# EAGLE design MicroProcessor (EAGLE 9.6.0)
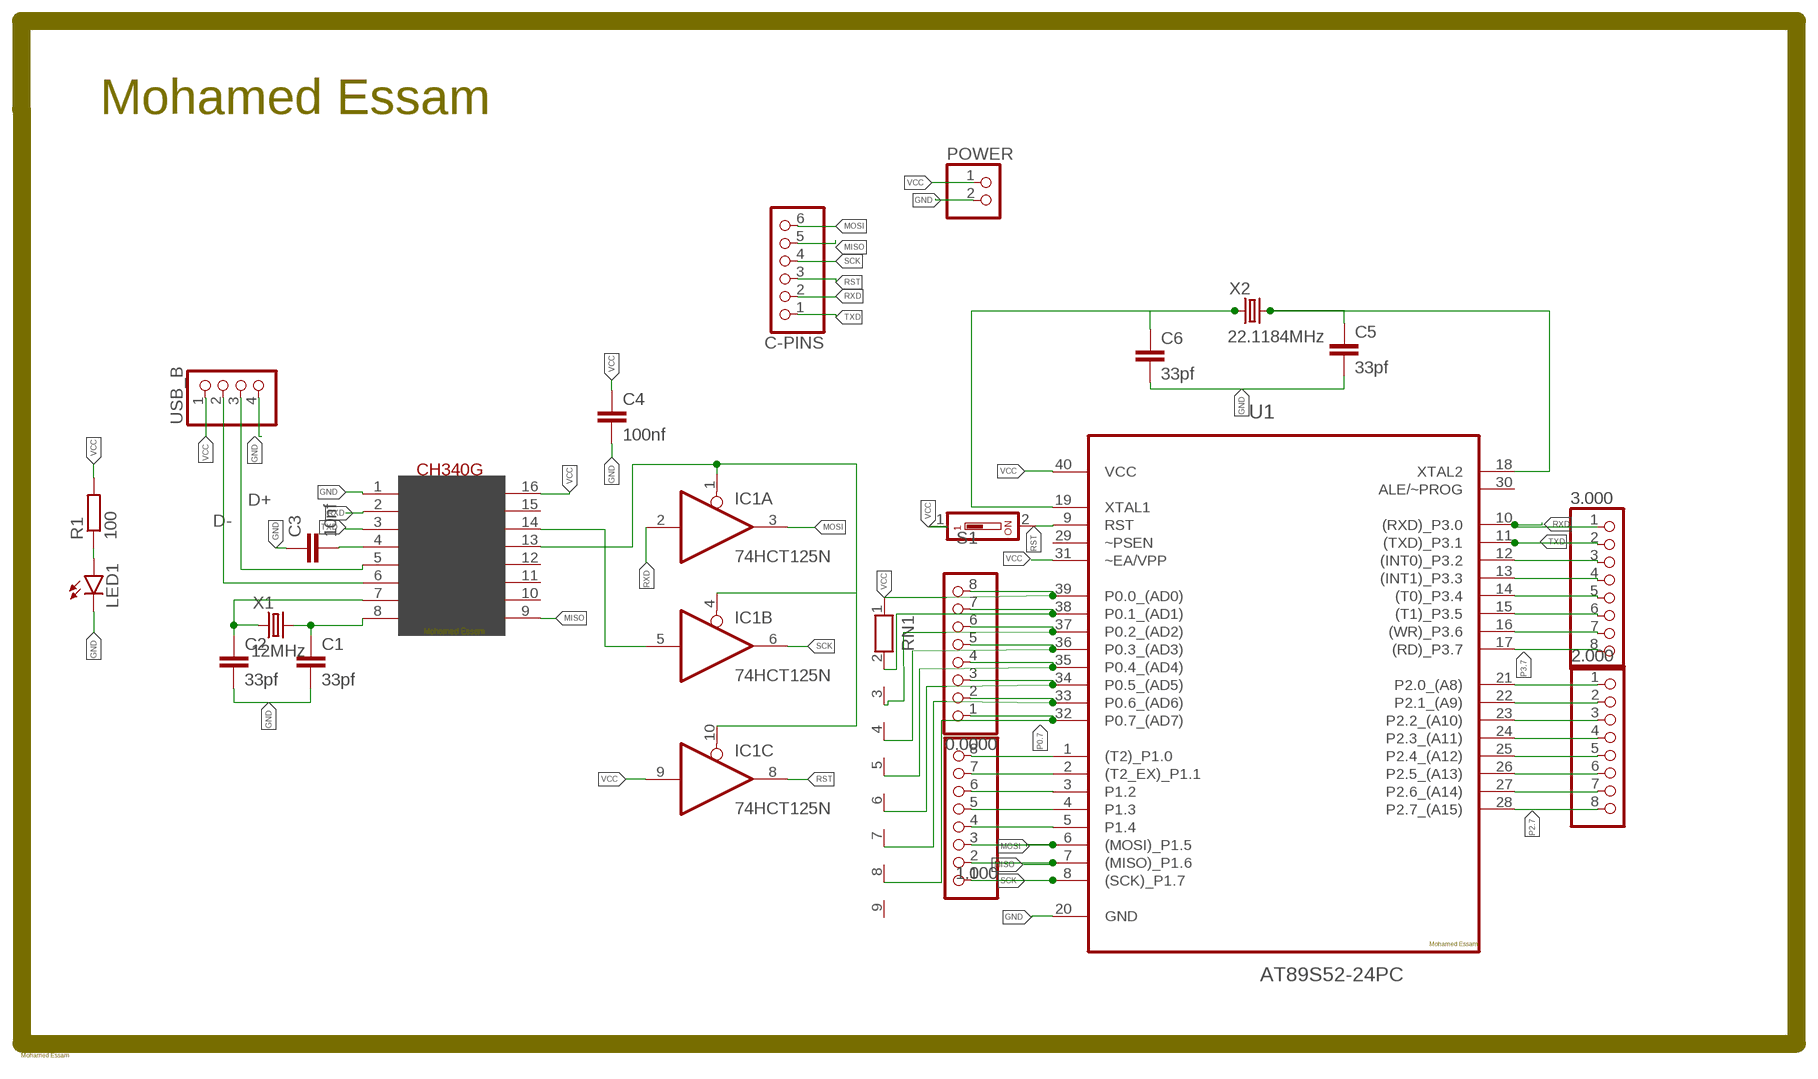
[diagram p0: schematic, sheet 1]

## Parts
0.0000  PINHD-1X8  [1X08]
1.000  PINHD-1X8  [1X08]
2.000  PINHD-1X8  [1X08]
3.000  PINHD-1X8  [1X08]
C1  33pf  CAPACITOR  [C025-025X050]
C2  33pf  CAPACITOR  [C025-025X050]
C3  10nf  C-EU025-025X050  [C025-025X050]
C4  100nf  CAPACITOR  [C025-025X050]
C5  33pf  CAPACITOR  [C025-025X050]
C6  33pf  CAPACITOR  [C025-025X050]
C-PINS  PINHD-1X6  [1X06]
IC1  74HCT125N  [DIL14]
LED1  LED5MM  [LED5MM]
POWER  PINHD-1X2  [1X02]
R1  100  R-EU_0204/7  [0204/7]
RN1  RN08  [RN-9]
S1  SD4-01  [SD4-01]
U1  AT89S52-24PC  [DIP254P1524X482-40]
U$1  CH340G  [SOIC16]
USB_B  PINHD-1X4  [1X04]
X1  12MHz  49S/18PF  [XTAL_HC49]
X2  22.1184MHz  49S/18PF  [XTAL_HC49]

## Nets
D+: U$1.5(D+) USB_B.3
D-: U$1.6(D-) USB_B.2
GND: C1.2 C2.2 C3.1 C4.2 C5.2 C6.2 LED1.K(C) POWER.2 U1.20(GND) U$1.1(GND) USB_B.4
MISO: 1.000.2 C-PINS.5 U1.7((MISO)_P1.6) U$1.9(CTS)
MOSI: 1.000.3 C-PINS.6 IC1.3(A:O) U1.6((MOSI)_P1.5)
N$1: LED1.A R1.1
N$2: C2.1 U$1.7(XI) X1.1
N$3: C1.1 U$1.8(XO) X1.2
N$4: C3.2 U$1.4(V3)
N$5: IC1.1(A:OE) IC1.4(B:OE) IC1.10(C:OE) U$1.13(DTR)
N$6: IC1.5(B:I) U$1.14(RTS)
N$7: C6.1 U1.19(XTAL1) X2.1
N$8: 0.0000.7 RN1.2 U1.38(P0.1_(AD1))
N$9: 0.0000.6 RN1.3 U1.37(P0.2_(AD2))
N$10: 0.0000.5 RN1.4 U1.36(P0.3_(AD3))
N$11: 0.0000.4 RN1.5 U1.35(P0.4_(AD4))
N$12: 0.0000.3 RN1.6 U1.34(P0.5_(AD5))
N$13: 0.0000.2 RN1.7 U1.33(P0.6_(AD6))
N$14: 1.000.8 U1.1((T2)_P1.0)
N$15: C5.1 U1.18(XTAL2) X2.2
N$16: 2.000.1 U1.21(P2.0_(A8))
N$17: 2.000.2 U1.22(P2.1_(A9))
N$18: 2.000.3 U1.23(P2.2_(A10))
N$19: 2.000.4 U1.24(P2.3_(A11))
N$20: 2.000.5 U1.25(P2.4_(A12))
N$21: 2.000.6 U1.26(P2.5_(A13))
N$22: 2.000.7 U1.27(P2.6_(A14))
N$23: 1.000.7 U1.2((T2_EX)_P1.1)
N$24: 3.000.3 U1.12((INT0)_P3.2)
N$25: 3.000.4 U1.13((INT1)_P3.3)
N$26: 3.000.5 U1.14((T0)_P3.4)
N$27: 3.000.6 U1.15((T1)_P3.5)
N$28: 3.000.7 U1.16((WR)_P3.6)
N$29: 1.000.6 U1.3(P1.2)
N$30: 1.000.5 U1.4(P1.3)
N$31: 1.000.4 U1.5(P1.4)
P0.7: 0.0000.1 RN1.8 U1.32(P0.7_(AD7))
P2.7: 2.000.8 U1.28(P2.7_(A15))
P3.7: 3.000.8 U1.17((RD)_P3.7)
RST: C-PINS.3 IC1.8(C:O) S1.2 U1.9(RST)
RXD: 3.000.1 C-PINS.2 IC1.2(A:I) U1.10((RXD)_P3.0) U$1.2(TX)
SCK: 1.000.1 C-PINS.4 IC1.6(B:O) U1.8((SCK)_P1.7)
TXD: 3.000.2 C-PINS.1 U1.11((TXD)_P3.1) U$1.3(RX)
VCC: 0.0000.8 C4.1 IC1.9(C:I) POWER.1 R1.2 RN1.1 S1.1 U1.31(~EA/VPP) U1.39(P0.0_(AD0)) U1.40(VCC) U$1.16(VCC) USB_B.1
Unconnected: IC1.11(D:O) IC1.12(D:I) IC1.13(D:OE) RN1.9 U1.29(~PSEN) U1.30(ALE/~PROG) U$1.10(DSR) U$1.11(RI) U$1.12(DCD) U$1.15(RS232)

## Notes on the sheet
- Mohamed Essam
- Mohamed Essam
- Mohamed Essam
- Mohamed Essam
- Mohamed Essam

## Power pins joined to a net without a drawn wire
GND: IC1.7(P:GND)
VCC: IC1.14(P:VCC)

## Library data of the parts
0.0000 1.000 2.000 3.000 = pinhead:PINHD-1X8: PIN HEADER
C1 C2 C4-C6 = MIA_LIBRARY-2-2-2:CAPACITOR
C3 = rcl:C-EU: CAPACITOR, European symbol; SPICEPREFIX: C
C-PINS = pinhead:PINHD-1X6: PIN HEADER
IC1 = 74xx-eu:74*125: Quad bus BUFFER, 3-state
LED1 = led:LED: LED OSRAM: - CHIPLED LG R971, LG N971, LY N971, LG Q971, LY Q971, LO R971, LY R971 LH N974, LH R974 LS Q976, LO Q976, LY Q976 LO Q996 - Hyper CHIPLED LW Q18S LB Q993, LB Q99A, LB R99A - SideLED LS A670, LO A670, LY A670, LG A670, LP A670 LB A673, LV A673, LT A673, LW A673 LH A674 LY A675 LS A676, LA A676, LO A676, LY A676, LW A676 LS A679, LY A679, LG A679 - Hyper Micro SIDELED® LS Y876, LA Y876, LO Y876, LY Y876 LT Y87S - SmartLED LW L88C, LW L88S LB L89C, LB L89S, LG L890 LS L89K, LO L89K, LY L89K LS L896, LA L896, LO L896, LY L896 - TOPLED LS T670, LO T670, LY T670, LG T670, LP T670 LSG T670, LSP T670, LSY T670, LOP T670, LYG T670 LG T671, LOG T671, LSG T671 LB T673, LV T673, LT T673, LW T673 LH T674 LS T676, LA T676, LO T676, LY T676, LB T676, LH T676, LSB T676, LW T676 LB T67C, LV T67C, LT T67C, LS T67K, LO T67K, LY T67K, LW E67C LS E67B, LA E67B, LO E67B, LY E67B, LB E67C, LV E67C, LT E67C LW T67C LS T679, LY T679, LG T679 LS T770, LO T770, LY T770, LG T770, LP T770 LB T773, LV T773, LT T773, LW T773 LH T774 LS E675, LA E675, LY E675, LS T675 LS T776, LA T776, LO T776, LY T776, LB T776 LHGB T686 LT T68C, LB T68C - Hyper Mini TOPLED® LB M676 - Mini TOPLED Santana® LG M470 LS M47K, LO M47K, LY M47K Source: http://www.osram.convergy.de LUXEON: - LUMILED® LXK2-PW12-R00, LXK2-PW12-S00, LXK2-PW14-U00, LXK2-PW14-V00 LXK2-PM12-R00, LXK2-PM12-S00, LXK2-PM14-U00 LXK2-PE12-Q00, LXK2-PE12-R00, LXK2-PE12-S00, LXK2-PE14-T00, LXK2-PE14-U00 LXK2-PB12-K00, LXK2-PB12-L00, LXK2-PB12-M00, LXK2-PB14-N00, LXK2-PB14-P00, LXK2-PB14-Q00 LXK2-PR12-L00, LXK2-PR12-M00, LXK2-PR14-Q00, LXK2-PR14-R00 LXK2-PD12-Q00, LXK2-PD12-R00, LXK2-PD12-S00 LXK2-PH12-R00, LXK2-PH12-S00 LXK2-PL12-P00, LXK2-PL12-Q00, LXK2-PL12-R00 Source: www.luxeon.com KINGBRIGHT: KA-3528ASYC Source: www.kingbright.com
POWER = pinhead:PINHD-1X2: PIN HEADER
R1 = rcl:R-EU_: RESISTOR, European symbol; SPICEPREFIX: R
RN1 = resistor-net:RN08: RESISTOR NETWORK; OC_FARNELL: unknown; OC_NEWARK: unknown
S1 = switch-dil:SD4-01: DIL/CODE SWITCH; OC_FARNELL: unknown; OC_NEWARK: unknown
U1 = AT89S52-24PC:AT89S52-24PC: 8-bit Microcontroller; AVAILABILITY: Unavailable; DESCRIPTION: Ic Mcu 8bit 8kb Flash 40dip; MF: Microchip; MP: AT89S52-24PC; PACKAGE: DIP-40 Microchip; PRICE: None
U$1 = usb-serial:CH340G
USB_B = pinhead:PINHD-1X4: PIN HEADER
X1 X2 = Crystals:49S/18PF: Crystal Manufacturer's datasheet <https://datasheet.octopart.com/49S-18PF-Xinhunjing-datasheet-30677139.pdf>; CREATED_BY: PCBLayout.com; MANUFACTURER: Xinhunjing; MPN: 49S/18PF; PACKAGE: SMD

## Board
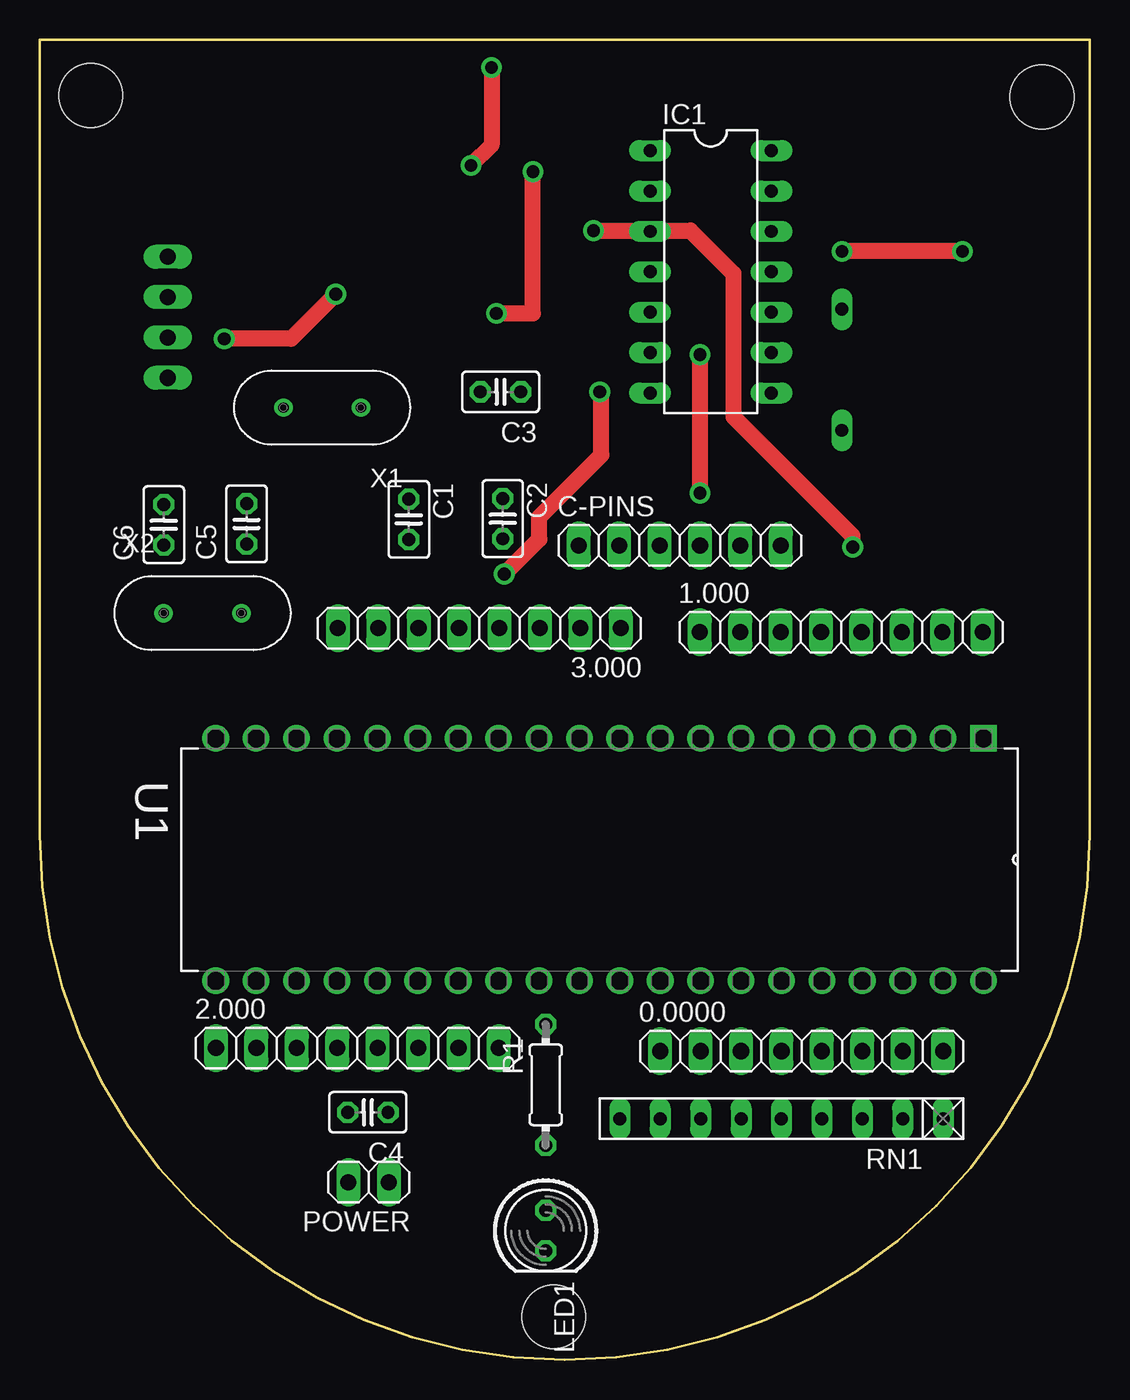
[diagram p1: board, top side]
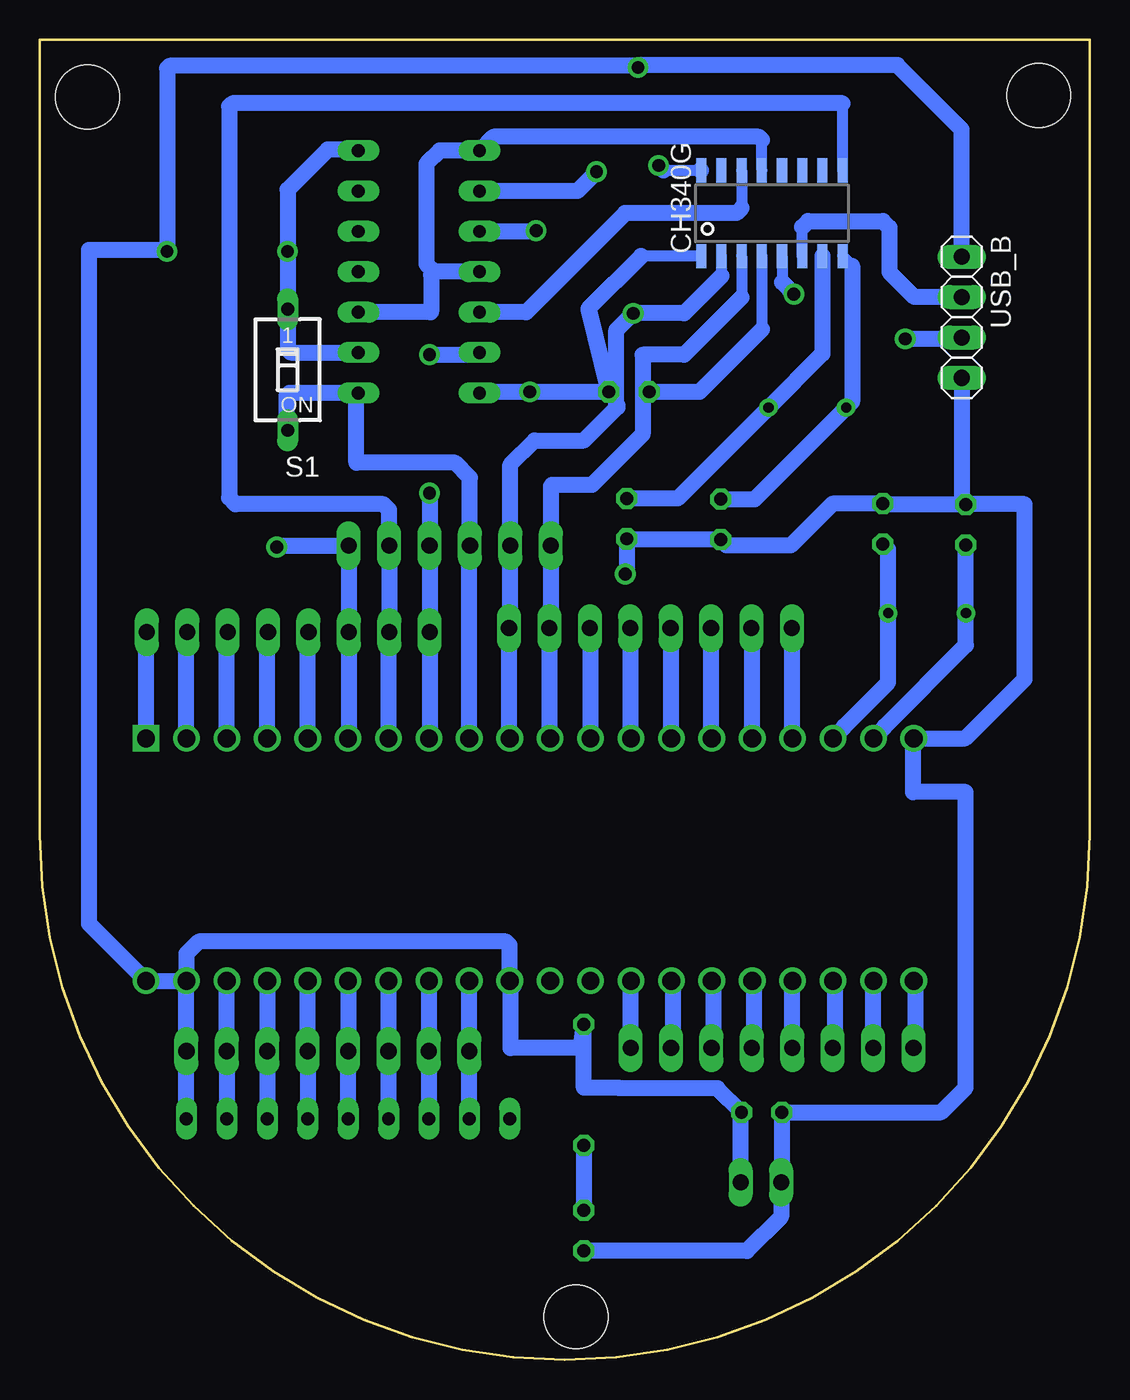
[diagram p2: board, bottom side, seen from below]

Size 66 x 83 mm. Coordinates in mm from the lower left corner, seen from the top.
Outline: 0,83 0,33 arc180 66,33 66,83 0,83
Copper layers (1*16): Top 0.035mm / dielectric 1.5mm / Bottom 0.035mm
Design rules "default *": minimum track width 1mm, minimum drill 0.35mm, track to track 0.6mm, track to pad 0.5mm, pad to pad 6mil, via to via 6mil, smd to smd 6mil, copper to edge 40mil, drill to drill 6mil, minimum pad ring 10mil, minimum via ring 8mil, stop-mask expansion 4mil, vias tented up to drill 0mil, thermal gap 10mil
Holes 4 mm at 32.3,2.7 63,79.4 3.2,79.5

### Footprints (pad centres in the part's own frame; a part is rotated, then mirrored left to right if it is on the bottom)
1X08 = drill 1.016 long: 1 -8.89,0; 2 -6.35,0; 3 -3.81,0; 4 -1.27,0; 5 1.27,0; 6 3.81,0; 7 6.35,0; 8 8.89,0
C025-025X050 = drill 0.813 octagon: 1 -1.27,0; 2 1.27,0
1X06 = drill 1.016 long: 1 -6.35,0; 2 -3.81,0; 3 -1.27,0; 4 1.27,0; 5 3.81,0; 6 6.35,0
DIL14 = drill 0.813 long: 1 -7.62,-3.81; 2 -5.08,-3.81; 3 -2.54,-3.81; 4 0,-3.81; 5 2.54,-3.81; 6 5.08,-3.81; 7 7.62,-3.81; 8 7.62,3.81; 9 5.08,3.81; 10 2.54,3.81; 11 0,3.81; 12 -2.54,3.81; 13 -5.08,3.81; 14 -7.62,3.81
LED5MM = drill 0.813 octagon: A -1.27,0; K 1.27,0
1X02 = drill 1.016 long: 1 -1.27,0; 2 1.27,0
0204/7 = drill 0.813 octagon: 1 -3.81,0; 2 3.81,0
RN-9 = drill 0.813 long: 1 -10.16,0; 2 -7.62,0; 3 -5.08,0; 4 -2.54,0; 5 0,0; 6 2.54,0; 7 5.08,0; 8 7.62,0; 9 10.16,0
SD4-01 = drill 0.813 long: 1 0,-3.81; 2 0,3.81
DIP254P1524X482-40 = drill 1.118 square: 1 -15.24,48.26 | drill 1.118: 2 -15.24,45.72; 3 -15.24,43.18; 4 -15.24,40.64; 5 -15.24,38.1; 6 -15.24,35.56; 7 -15.24,33.02; 8 -15.24,30.48; 9 -15.24,27.94; 10 -15.24,25.4; 11 -15.24,22.86; 12 -15.24,20.32; 13 -15.24,17.78; 14 -15.24,15.24; 15 -15.24,12.7; 16 -15.24,10.16; 17 -15.24,7.62; 18 -15.24,5.08; 19 -15.24,2.54; 20 -15.24,0; 21 0,0; 22 0,2.54; 23 0,5.08; 24 0,7.62; 25 0,10.16; 26 0,12.7; 27 0,15.24; 28 0,17.78; 29 0,20.32; 30 0,22.86; 31 0,25.4; 32 0,27.94; 33 0,30.48; 34 0,33.02; 35 0,35.56; 36 0,38.1; 37 0,40.64; 38 0,43.18; 39 0,45.72; 40 0,48.26
SOIC16 = smd 0.635 x 1.524: 1 -4.445,-2.695; 2 -3.175,-2.695; 3 -1.905,-2.695; 4 -0.635,-2.695; 5 0.635,-2.695; 6 1.905,-2.695; 7 3.175,-2.695; 8 4.445,-2.695; 9 4.445,2.695; 10 3.175,2.695; 11 1.905,2.695; 12 0.635,2.695; 13 -0.635,2.695; 14 -1.905,2.695; 15 -3.175,2.695; 16 -4.445,2.695
1X04 = drill 1.016 long: 1 -3.81,0; 2 -1.27,0; 3 1.27,0; 4 3.81,0
XTAL_HC49 = drill 0.65 pad 1.05: 1 -2.44,0; 2 2.44,0

### Placement (x,y rotation side)
0.0000  47.89,19.41 0 top
1.000  50.38,45.75 0 top
2.000  19.97,19.6 0 top
3.000  27.62,46 180 top
C1  23.2,52.84 270 top
C2  29.1,52.89 270 top
C3  28.97,60.86 180 top
C4  20.62,15.56 180 top
C5  13,52.56 90 top
C6  7.8,52.51 90 top
C-PINS  40.23,51.2 0 top
IC1  42.17,68.41 270 top
LED1  31.8,8.12 270 top
POWER  20.67,11.16 180 top
R1  31.8,17.29 90 top
RN1  46.62,15.16 180 top
S1  50.42,62.25 180 bottom
U1  11.06,23.83 270 top
U$1  19.98,72.09 0 bottom
USB_B  8.05,65.55 270 bottom
X1  17.75,59.87 180 top
X2  10.23,46.95 0 top

### Tracks (layer width: path | path; a pad name or v marks a point on that pad's centre or on a via)
D+  (via drill 0.8 pad 1.3)
  Top 1: v18.6,67 15.8,64.2 v11.6,64.2
  Bottom 0.7: U$1.5 19.34,67.75
  Bottom 1: 19.34,67.75 v18.6,67 | v11.6,64.2 8.13,64.2 USB_B.3
D-
  Bottom 0.7: U$1.6 18.07,71.22
  Bottom 1: USB_B.2 11.02,66.82 12.6,68.4 12.6,71.2 13,71.6 17.7,71.6 18.07,71.22
GND  (via drill 0.8 pad 1.3)
  Top 1: v29.2,49.4 31.4,51.6 31.4,53 35.3,56.9 35.3,60.76 v35.2,60.86
  Bottom 0.7: U$1.1 28.2,69.39
  Bottom 1: C6.2 12.95,53.78 C5.2 16.17,53.83 18.8,51.2 22.83,51.2 C1.2 29.05,51.57 C2.2 29.1,49.5 v29.2,49.4 | C6.2 7.78,53.8 4.1,53.8 4.1,42.8 7.83,39.07 U1.20 11.1,39.03 11.1,35.7 7.8,35.7 7.8,17.1 9.34,15.56 C4.2 19.35,11.21 POWER.2 19.4,9 21.55,6.85 LED1.K | IC1.7 38.29,60.86 v35.2,60.86 C3.1 31.51,66.09 28.2,69.39 | USB_B.4 8.05,54.03 C6.2
MISO
  Bottom 0.7: U$1.9 15.54,79
  Bottom 1: U1.7 44.08,45.7 1.000.2 | 1.000.2 | 1.000.2 C-PINS.5 44.04,53.44 44.4,53.8 53.7,53.8 54.1,54.2 54.1,78.8 53.9,79 15.54,79
MOSI  (via drill 0.8 pad 1.3)
  Top 1: v34.8,71 40.9,71 43.6,68.3 43.6,59.3 51.1,51.8 v51.1,51.1
  Bottom 1: U1.6 46.57,39.12 1.000.3 C-PINS.6 51.1,51.2 v51.1,51.1 | IC1.3 34.85,70.95 v34.8,71
N$1
  Bottom 1: R1.1 LED1.A
N$2
  Bottom 1: U$1.7 16.8,63.25 X1.1 25.9,54.16 C2.1
N$3
  Bottom 0.7: U$1.8 14.93,68.8
  Bottom 1: 14.93,68.8 14.93,60.25 X1.2 21.07,54.11 C1.1
N$4
  Bottom 0.7: U$1.4 20.62,64.78
  Bottom 1: C3.2 24.54,60.86 20.62,64.78
N$5
  Bottom 0.7: U$1.13 20.62,76.72
  Bottom 1: IC1.4 41.21,68.41 | 41.21,68.41 41.7,68.9 41.7,75.2 40.87,76.03 IC1.1 37.49,76.9 20.8,76.9 20.62,76.72 | 41.21,68.41 41.4,68.22 41.4,65.9 41.43,65.87 IC1.10
N$6
  Bottom 0.7: U$1.14 21.88,72.41
  Bottom 1: IC1.5 35.43,65.87 29.2,72.1 22.2,72.1 21.88,72.41
N$7
  Bottom 1: U1.19 12.9,39.77 12.9,39.83 7.79,44.94 X2.1 C6.1
N$8
  Bottom 1: U1.38 0.0000.7 RN1.2
N$9
  Bottom 1: U1.37 0.0000.6 RN1.3
N$10
  Bottom 1: U1.36 0.0000.5 RN1.4
N$11
  Bottom 1: U1.35 0.0000.4 RN1.5
N$12
  Bottom 1: U1.34 0.0000.3 RN1.6
N$13
  Bottom 1: U1.33 0.0000.2 RN1.7
N$14
  Bottom 1: U1.1 59.32,45.7 1.000.8
N$15
  Bottom 1: U1.18 15.44,39.77 15.44,39.83 12.67,42.6 X2.2 12.67,50.96 C5.1
N$16
  Bottom 1: U1.21 10.96,23.73 10.96,19.72 2.000.1
N$17
  Bottom 1: 2.000.2 13.62,23.81 U1.22
N$18
  Bottom 1: U1.23 16.04,23.73 16.04,19.72 2.000.3
N$19
  Bottom 1: 2.000.4 18.7,23.81 U1.24
N$20
  Bottom 1: U1.25 21.12,23.73 21.12,19.72 2.000.5
N$21
  Bottom 1: 2.000.6 23.66,19.72 23.66,23.73 U1.26
N$22
  Bottom 1: U1.27 26.2,23.73 26.2,19.72 2.000.7
N$23
  Bottom 1: U1.2 56.78,45.7 1.000.7
N$24
  Bottom 1: U1.12 31.38,45.95 3.000.3
N$25
  Bottom 1: 3.000.4 28.89,39.12 U1.13
N$26
  Bottom 1: U1.14 26.3,45.95 3.000.5
N$27
  Bottom 1: 3.000.6 23.81,39.12 U1.15
N$28
  Bottom 1: U1.16 21.22,45.95 3.000.7
N$29
  Bottom 1: U1.3 54.24,45.7 1.000.6
N$30
  Bottom 1: U1.4 51.7,45.7 1.000.5
N$31
  Bottom 1: U1.5 49.16,45.7 1.000.4
P0.7
  Bottom 1: U1.32 0.0000.1 RN1.8
P2.7
  Bottom 1: 2.000.8 28.86,23.81 U1.28
P3.7
  Bottom 1: 3.000.8 18.73,39.12 U1.17
RST
  Bottom 1: U1.9 39,51.16 C-PINS.3 38.96,55.46 39.9,56.4 46.1,56.4 46.1,60.67 IC1.8 50.31,60.79 50.5,60.6 50.5,58.52 S1.2
RXD  (via drill 0.8 pad 1.3)
  Top 1: v31,74.7 31,65.8 v28.7,65.8
  Bottom 0.7: U$1.2 23.16,68.14
  Bottom 1: U1.10 36.51,39.12 3.000.1 36.42,46.09 C-PINS.2 36.42,56.28 34.9,57.8 31.8,57.8 29.7,59.9 29.7,60.02 29.75,59.97 29.75,64.75 v28.7,65.8 25.5,65.8 23.16,68.14 | v31,74.7 32.21,73.49 IC1.2
SCK  (via drill 0.8 pad 1.3)
  Top 1: v41.5,54.5 v41.5,63.2
  Bottom 1: U1.8 41.49,39.12 1.000.1 C-PINS.4 v41.5,54.5 | v41.5,63.2 38.49,63.2 IC1.6
TXD
  Bottom 0.7: U$1.3 21.88,66.81
  Bottom 1: U1.11 33.97,39.12 3.000.2 33.88,46.09 C-PINS.1 33.88,54.92 33.8,55 31.3,55 28.1,58.2 28.1,63.2 25.5,63.2 21.88,66.81
VCC  (via drill 0.8 pad 1.3)
  Top 1: v58,69.7 v50.42,69.7 | v28.4,81.26 28.4,76.4 v27.1,75.1
  Bottom 0.7: 26.79,74.78 24.47,74.78
  Bottom 1: U1.39 0.0000.8 RN1.1 | POWER.1 21.94,15.51 C4.1 23.41,17.08 29.59,17.08 29.61,17.1 31.8,17.1 R1.2 32.03,19.6 36.4,19.6 36.4,23.37 36.2,23.57 U1.31 36.46,26.06 36.7,26.3 56,26.3 56.78,25.52 U1.39 | 46.05,76.1 47.9,76.1 50.42,73.58 v50.42,69.7 S1.1 50.42,63.52 50.23,63.33 IC1.9 | 46.05,76.1 IC1.14 | U1.39 U1.40 62.9,27.41 62.9,69.8 58,69.8 | 46.1,76.15 46.05,76.1 | 58,69.8 v58,69.7 | USB_B.1 8.05,77.36 12.1,81.41 28.25,81.41 28.36,81.3 | 28.36,81.3 28.4,81.3 | v27.1,75.1 26.79,74.78 | 24.47,74.8 24.47,74.78 U$1.16 | 58,69.8 58,81.2 57.84,81.36 28.5,81.36 v28.4,81.26 28.36,81.3